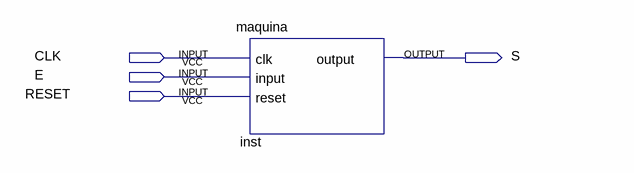
[diagram p0: schematic sheet]
// Quartus schematic maquinavhdl.bdf as structural Verilog: 1 symbols, 4 pins
module maquinavhdl (
  input  CLK,
  input  E,
  input  RESET,
  output S
);

  maquina inst (.clk(CLK), .\input (E), .reset(RESET), .\output (S));
endmodule
